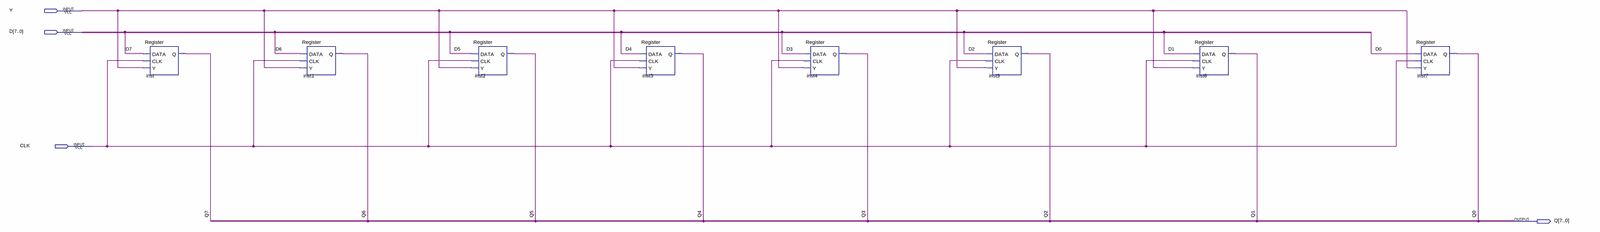
[diagram p0: schematic sheet, whole]
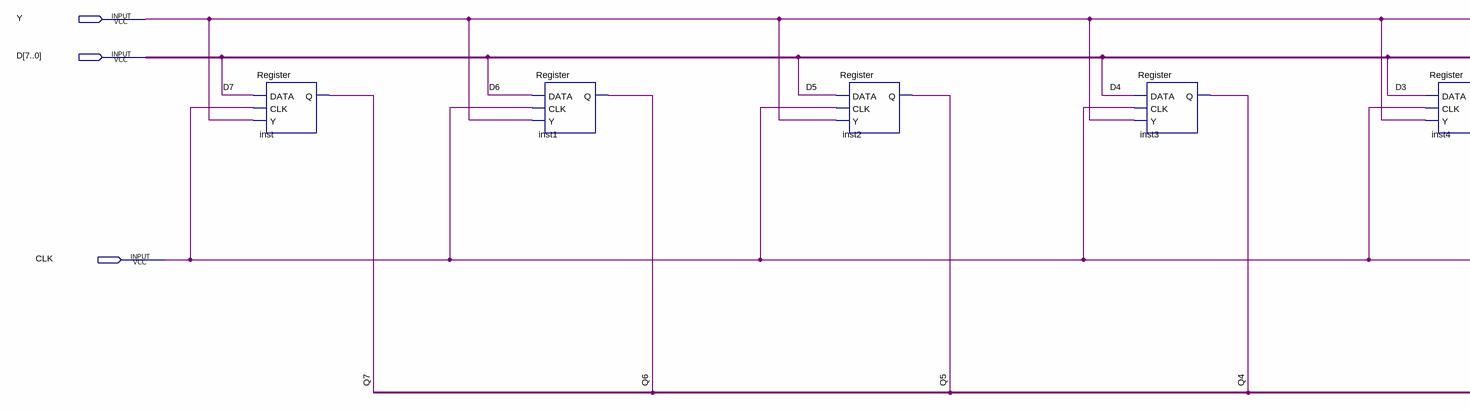
[diagram p1: schematic sheet, left part]
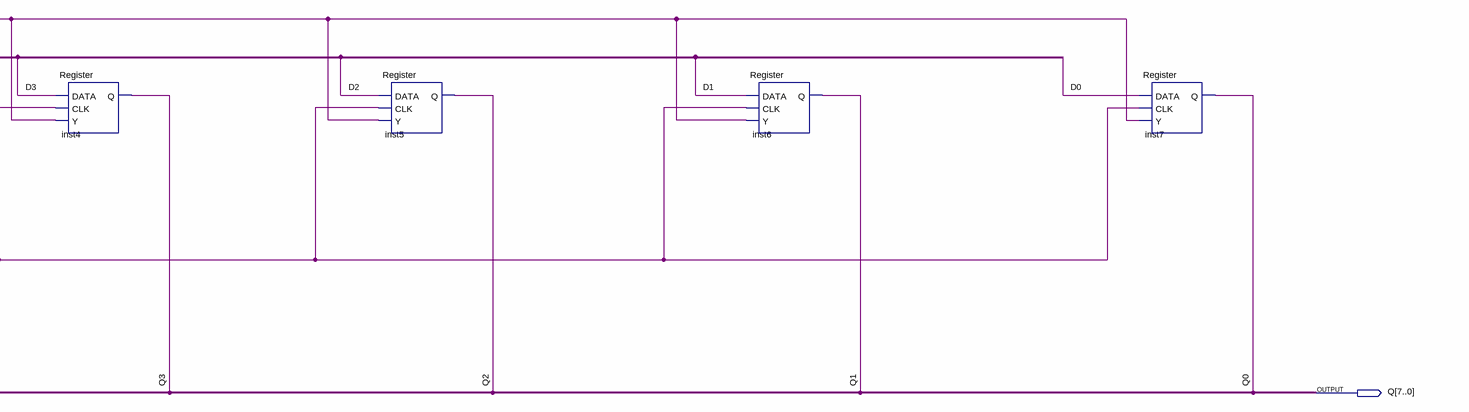
[diagram p2: schematic sheet, right part]
// Quartus schematic reg_8b.bdf as structural Verilog: 8 symbols, 4 pins
module reg_8b (
  input  Y,
  input  [7:0] D,
  input  CLK,
  output [7:0] Q
);

  Register inst (.DATA(D[7]), .CLK(CLK), .Y(Y), .Q(Q[7]));
  Register inst1 (.DATA(D[6]), .CLK(CLK), .Y(Y), .Q(Q[6]));
  Register inst2 (.DATA(D[5]), .CLK(CLK), .Y(Y), .Q(Q[5]));
  Register inst3 (.DATA(D[4]), .CLK(CLK), .Y(Y), .Q(Q[4]));
  Register inst4 (.DATA(D[3]), .CLK(CLK), .Y(Y), .Q(Q[3]));
  Register inst5 (.DATA(D[2]), .CLK(CLK), .Y(Y), .Q(Q[2]));
  Register inst6 (.DATA(D[1]), .CLK(CLK), .Y(Y), .Q(Q[1]));
  Register inst7 (.DATA(D[0]), .CLK(CLK), .Y(Y), .Q(Q[0]));
endmodule
